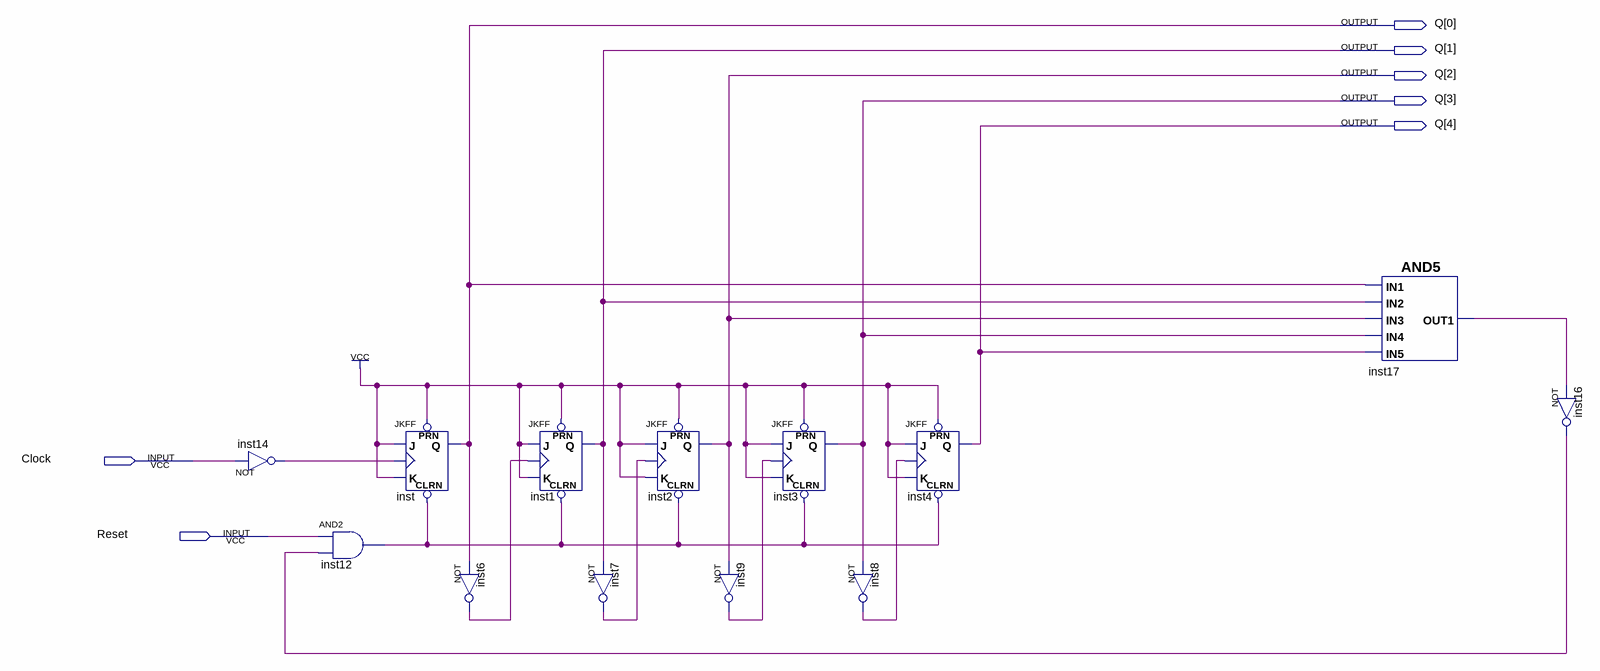
[diagram p0: schematic sheet]
// Quartus schematic contador.bdf as structural Verilog: 13 symbols, 7 pins
module contador (
  input  Clock,
  input  Reset,
  output [4:0] Q
);

  wire inst6_out, inst7_out, inst8_out, inst9_out, inst12_out, inst14_out, inst16_out, inst17_out1;

  not inst14 (inst14_out, Clock);
  and inst12 (inst12_out, Reset, inst16_out);
  JKFF inst (.PRN(1'b1), .CLRN(inst12_out), .K(1'b1), .J(1'b1), .CLK(inst14_out), .Q(Q[0]));
  not inst6 (inst6_out, Q[0]);
  JKFF inst1 (.PRN(1'b1), .CLRN(inst12_out), .K(1'b1), .J(1'b1), .CLK(inst6_out), .Q(Q[1]));
  not inst7 (inst7_out, Q[1]);
  JKFF inst2 (.PRN(1'b1), .CLRN(inst12_out), .K(1'b1), .J(1'b1), .CLK(inst7_out), .Q(Q[2]));
  not inst9 (inst9_out, Q[2]);
  JKFF inst3 (.PRN(1'b1), .CLRN(inst12_out), .K(1'b1), .J(1'b1), .CLK(inst9_out), .Q(Q[3]));
  not inst8 (inst8_out, Q[3]);
  JKFF inst4 (.PRN(1'b1), .CLRN(inst12_out), .K(1'b1), .J(1'b1), .CLK(inst8_out), .Q(Q[4]));
  AND5 inst17 (.IN3(Q[2]), .IN2(Q[1]), .IN1(Q[0]), .IN5(Q[4]), .IN4(Q[3]), .OUT1(inst17_out1));
  not inst16 (inst16_out, inst17_out1);
endmodule
